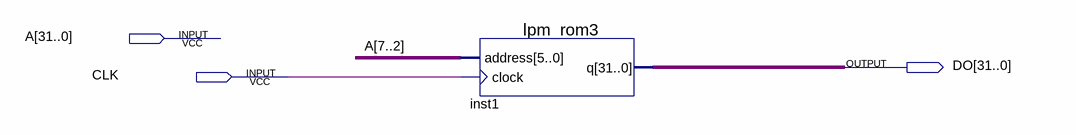
[diagram p0: schematic sheet]
// Quartus schematic sc_instmem_mul.bdf as structural Verilog: 1 symbols, 3 pins
module sc_instmem_mul (
  input  [31:0] A,
  input  CLK,
  output [31:0] DO
);

  lpm_rom3 inst1 (.address(A[7:2]), .clock(CLK), .q(DO));
endmodule
